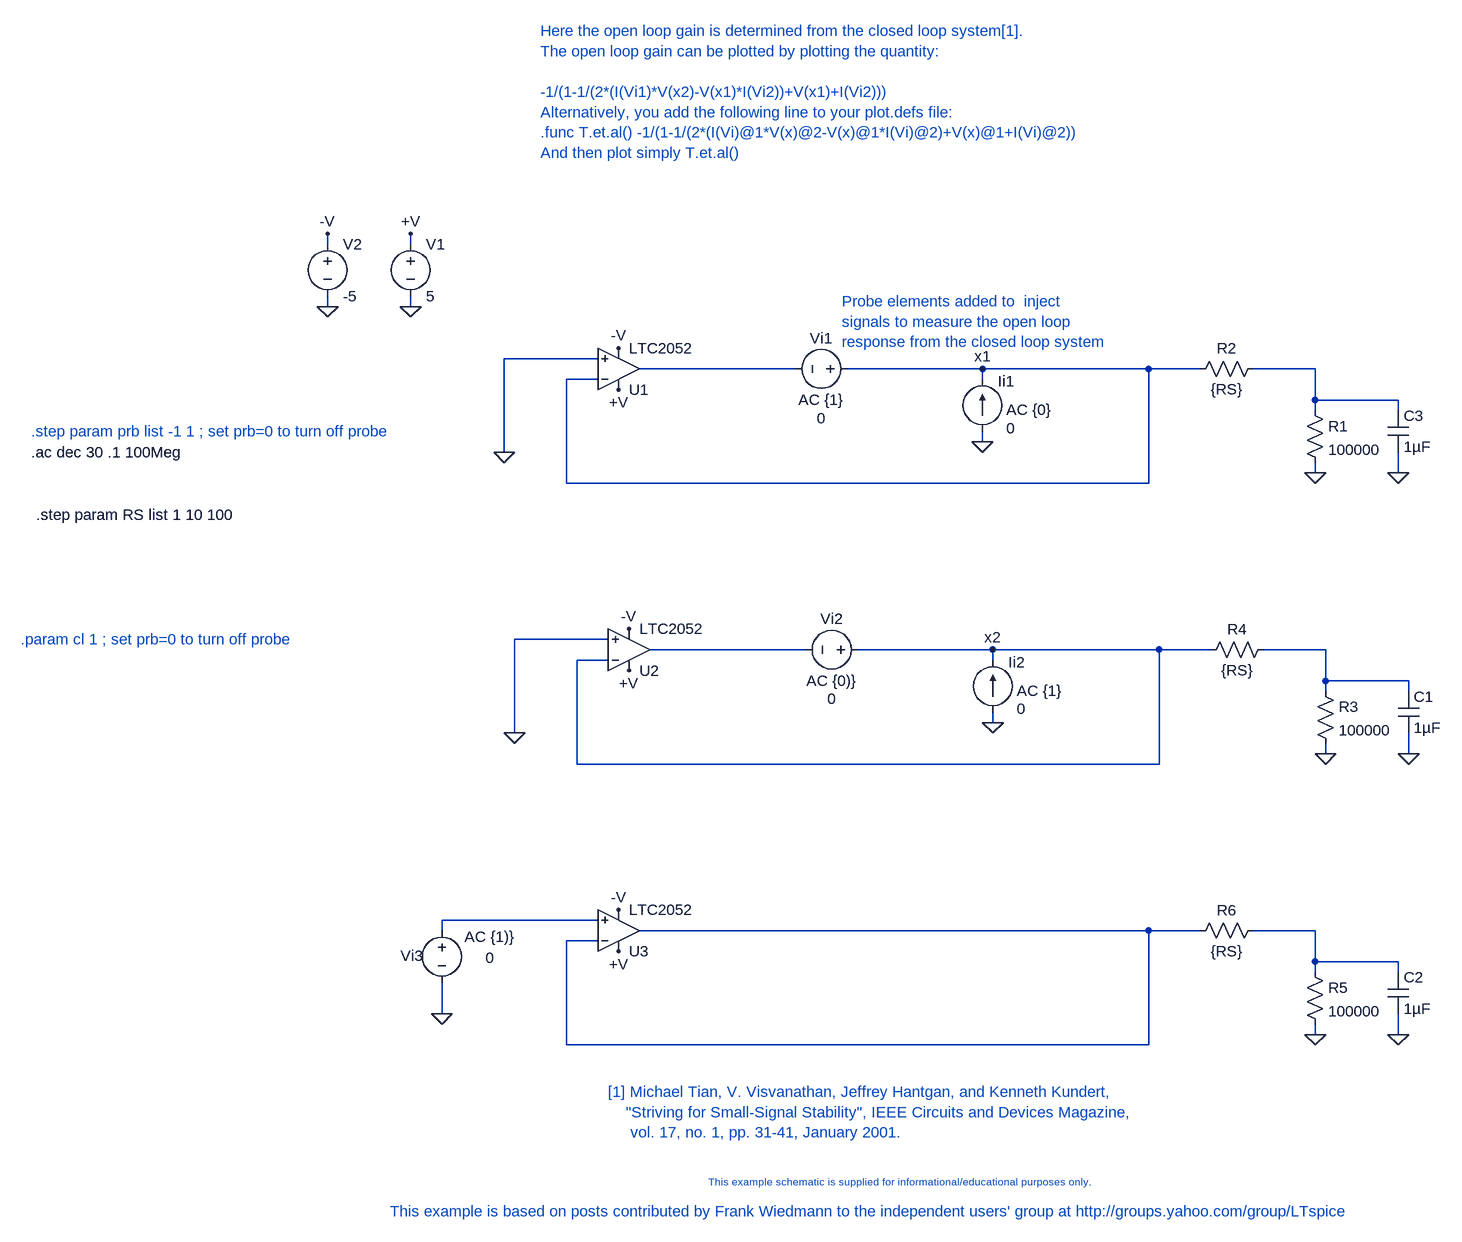
[diagram p0: schematic behavioral linear opamp stability 03.asc]
* behavioral linear opamp stability 03.asc
R1 N002 0 100000
Ii1 0 x1 0 AC {0}
Vi1 x1 N001 0 AC {1}
C3 N002 0 1µF
R2 N002 x1 {RS}
R3 N004 0 100000
Ii2 0 x2 0 AC {1}
Vi2 x2 N003 0 AC {0)}
C1 N004 0 1µF
R4 N004 x2 {RS}
R5 N007 0 100000
Vi3 N005 0 0 AC {1)}
C2 N007 0 1µF
R6 N007 N006 {RS}
* U1: LTC2052 (symbol Opamps\LTC2052 not available, pins judged from their places): In+=0 In-=x1 V+=+V V-=-V OUT=N001
V1 +V 0 5
V2 -V 0 -5
* U2: LTC2052 (symbol Opamps\LTC2052 not available, pins judged from their places): In+=0 In-=x2 V+=+V V-=-V OUT=N003
* U3: LTC2052 (symbol Opamps\LTC2052 not available, pins judged from their places): In+=N005 In-=N006 V+=+V V-=-V OUT=N006
.ac dec 30 .1 100Meg
* Here the open loop gain is determined from the closed loop system[1].
* The open loop gain can be plotted by plotting the quantity:
* -1/(1-1/(2*(I(Vi1)*V(x2)-V(x1)*I(Vi2))+V(x1)+I(Vi2)))
* Alternatively, you add the following line to your plot.defs file:
* .func T.et.al() -1/(1-1/(2*(I(Vi)@1*V(x)@2-V(x)@1*I(Vi)@2)+V(x)@1+I(Vi)@2))
* And then plot simply T.et.al()
* This example schematic is supplied for informational/educational purposes only.
* [1] Michael Tian, V. Visvanathan, Jeffrey Hantgan, and Kenneth Kundert,
*     "Striving for Small-Signal Stability", IEEE Circuits and Devices Magazine,
*      vol. 17, no. 1, pp. 31-41, January 2001.
* .step param prb list -1 1 ; set prb=0 to turn off probe
* Probe elements added to  inject
* signals to measure the open loop
* response from the closed loop system
* This example is based on posts contributed by Frank Wiedmann to the independent users' group at http://groups.yahoo.com/group/LTspice
.step param RS list 1 10 100
* .param cl 1 ; set prb=0 to turn off probe
.backanno
.end

* Results of the author's LTspice run, read from the files saved beside the schematic
* Operating Point (first step), zero values left out:
*   rs = 1 
*   V(+v) = 5 V
*   V(-v) = -5 V
*   I(V2) = 2.545 mA
*   I(V1) = -2.545 mA
*   Ix(u1:4) = 848.3 µA
*   Ix(u1:5) = -848.3 µA
*   Ix(u2:4) = 848.3 µA
*   Ix(u2:5) = -848.3 µA
*   Ix(u3:4) = 848.3 µA
*   Ix(u3:5) = -848.3 µA
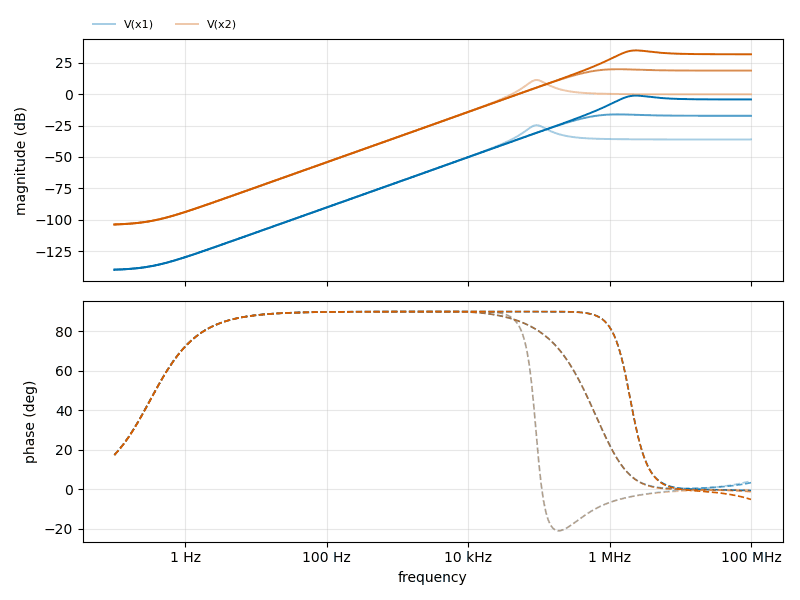
[diagram p1: AC Analysis of behavioral linear opamp stability 03.asc, plotted from the saved traces]
* AC Analysis, 3 runs:
*   V(x1) [rs=1]: -139.81 dB at 100 mHz, -36.10 dB at 100 MHz, peak -24.70 dB at 92.61 kHz, 3 dB below the peak at 71.41 kHz and 126.6 kHz
*   V(x1) [rs=10]: -139.81 dB at 100 mHz, -17.24 dB at 100 MHz, peak -16.14 dB at 1.359 MHz, 3 dB below the peak at 428.6 kHz
*   V(x1) [rs=100]: -139.81 dB at 100 mHz, -4.25 dB at 100 MHz, peak -1.18 dB at 2.326 MHz, 3 dB below the peak at 1.429 MHz and 26.17 MHz
*   V(x2) [rs=1]: -103.79 dB at 100 mHz, -0.14 dB at 100 MHz, peak 11.29 dB at 92.61 kHz, 3 dB below the peak at 71.41 kHz and 126.6 kHz
*   V(x2) [rs=10]: -103.79 dB at 100 mHz, 18.72 dB at 100 MHz, peak 19.84 dB at 1.359 MHz, 3 dB below the peak at 428.6 kHz
*   V(x2) [rs=100]: -103.79 dB at 100 mHz, 31.71 dB at 100 MHz, peak 34.81 dB at 2.326 MHz, 3 dB below the peak at 1.429 MHz and 25.75 MHz